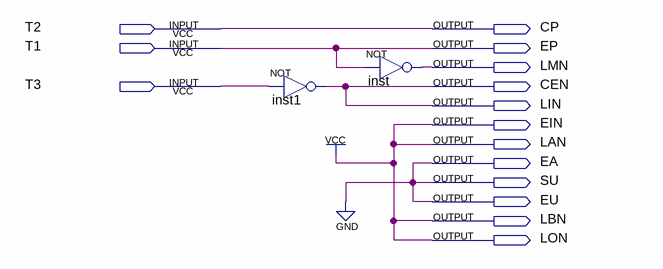
[diagram p0: schematic sheet]
// Quartus schematic CicloBusca.bdf as structural Verilog: 2 symbols, 15 pins
module CicloBusca (
  input  T2,
  input  T1,
  input  T3,
  output CP,
  output EP,
  output LMN,
  output CEN,
  output LIN,
  output EIN,
  output LAN,
  output EA,
  output SU,
  output EU,
  output LBN,
  output LON
);

  not inst1 (CEN, T3);
  not inst (LMN, T1);

  assign CP = T2;
  assign EA = 1'b0;
  assign EIN = 1'b1;
  assign EP = T1;
  assign EU = 1'b0;
  assign LAN = 1'b1;
  assign LBN = 1'b1;
  assign LIN = CEN;
  assign LON = 1'b1;
  assign SU = 1'b0;
endmodule
